# Altium project roach2_project rev2.PrjPCB (part 7 of 13)

## Sheet v6_io_12_13_14_15.SchDoc: Virtex-6 IO Banks 12, 13, 14 & 15
size A3; Date: DO NOT USE, RATHER USE PROJ OPTIONS; DrawnBy: DO NOT USE, RATHER USE PROJ OPTIONS; Engineer: DO NOT USE, RATHER USE PROJ OPTIONS; Organization: DO NOT USE, RATHER USE PROJ OPTIONS; DocumentNumber: DO NOT USE, RATHER USE PROJ OPTIONS; Revision: DO NOT USE, RATHER USE PROJ OPTIONS; SheetNumber: 14; SheetTotal: 27; SCH_Sheet_Filename: v6_io_12_13_14_15.SchDoc; CurrentTime: DO NOT USE, RATHER USE PROJ OPTIONS; Time: DO NOT USE, RATHER USE PROJ OPTIONS; DocumentFullPathAndName: DO NOT USE, RATHER USE PROJ OPTIONS; DocumentName: DO NOT USE, RATHER USE PROJ OPTIONS; ModifiedDate: DO NOT USE, RATHER USE PROJ OPTIONS; ImagePath: DO NOT USE, RATHER USE PROJ OPTIONS
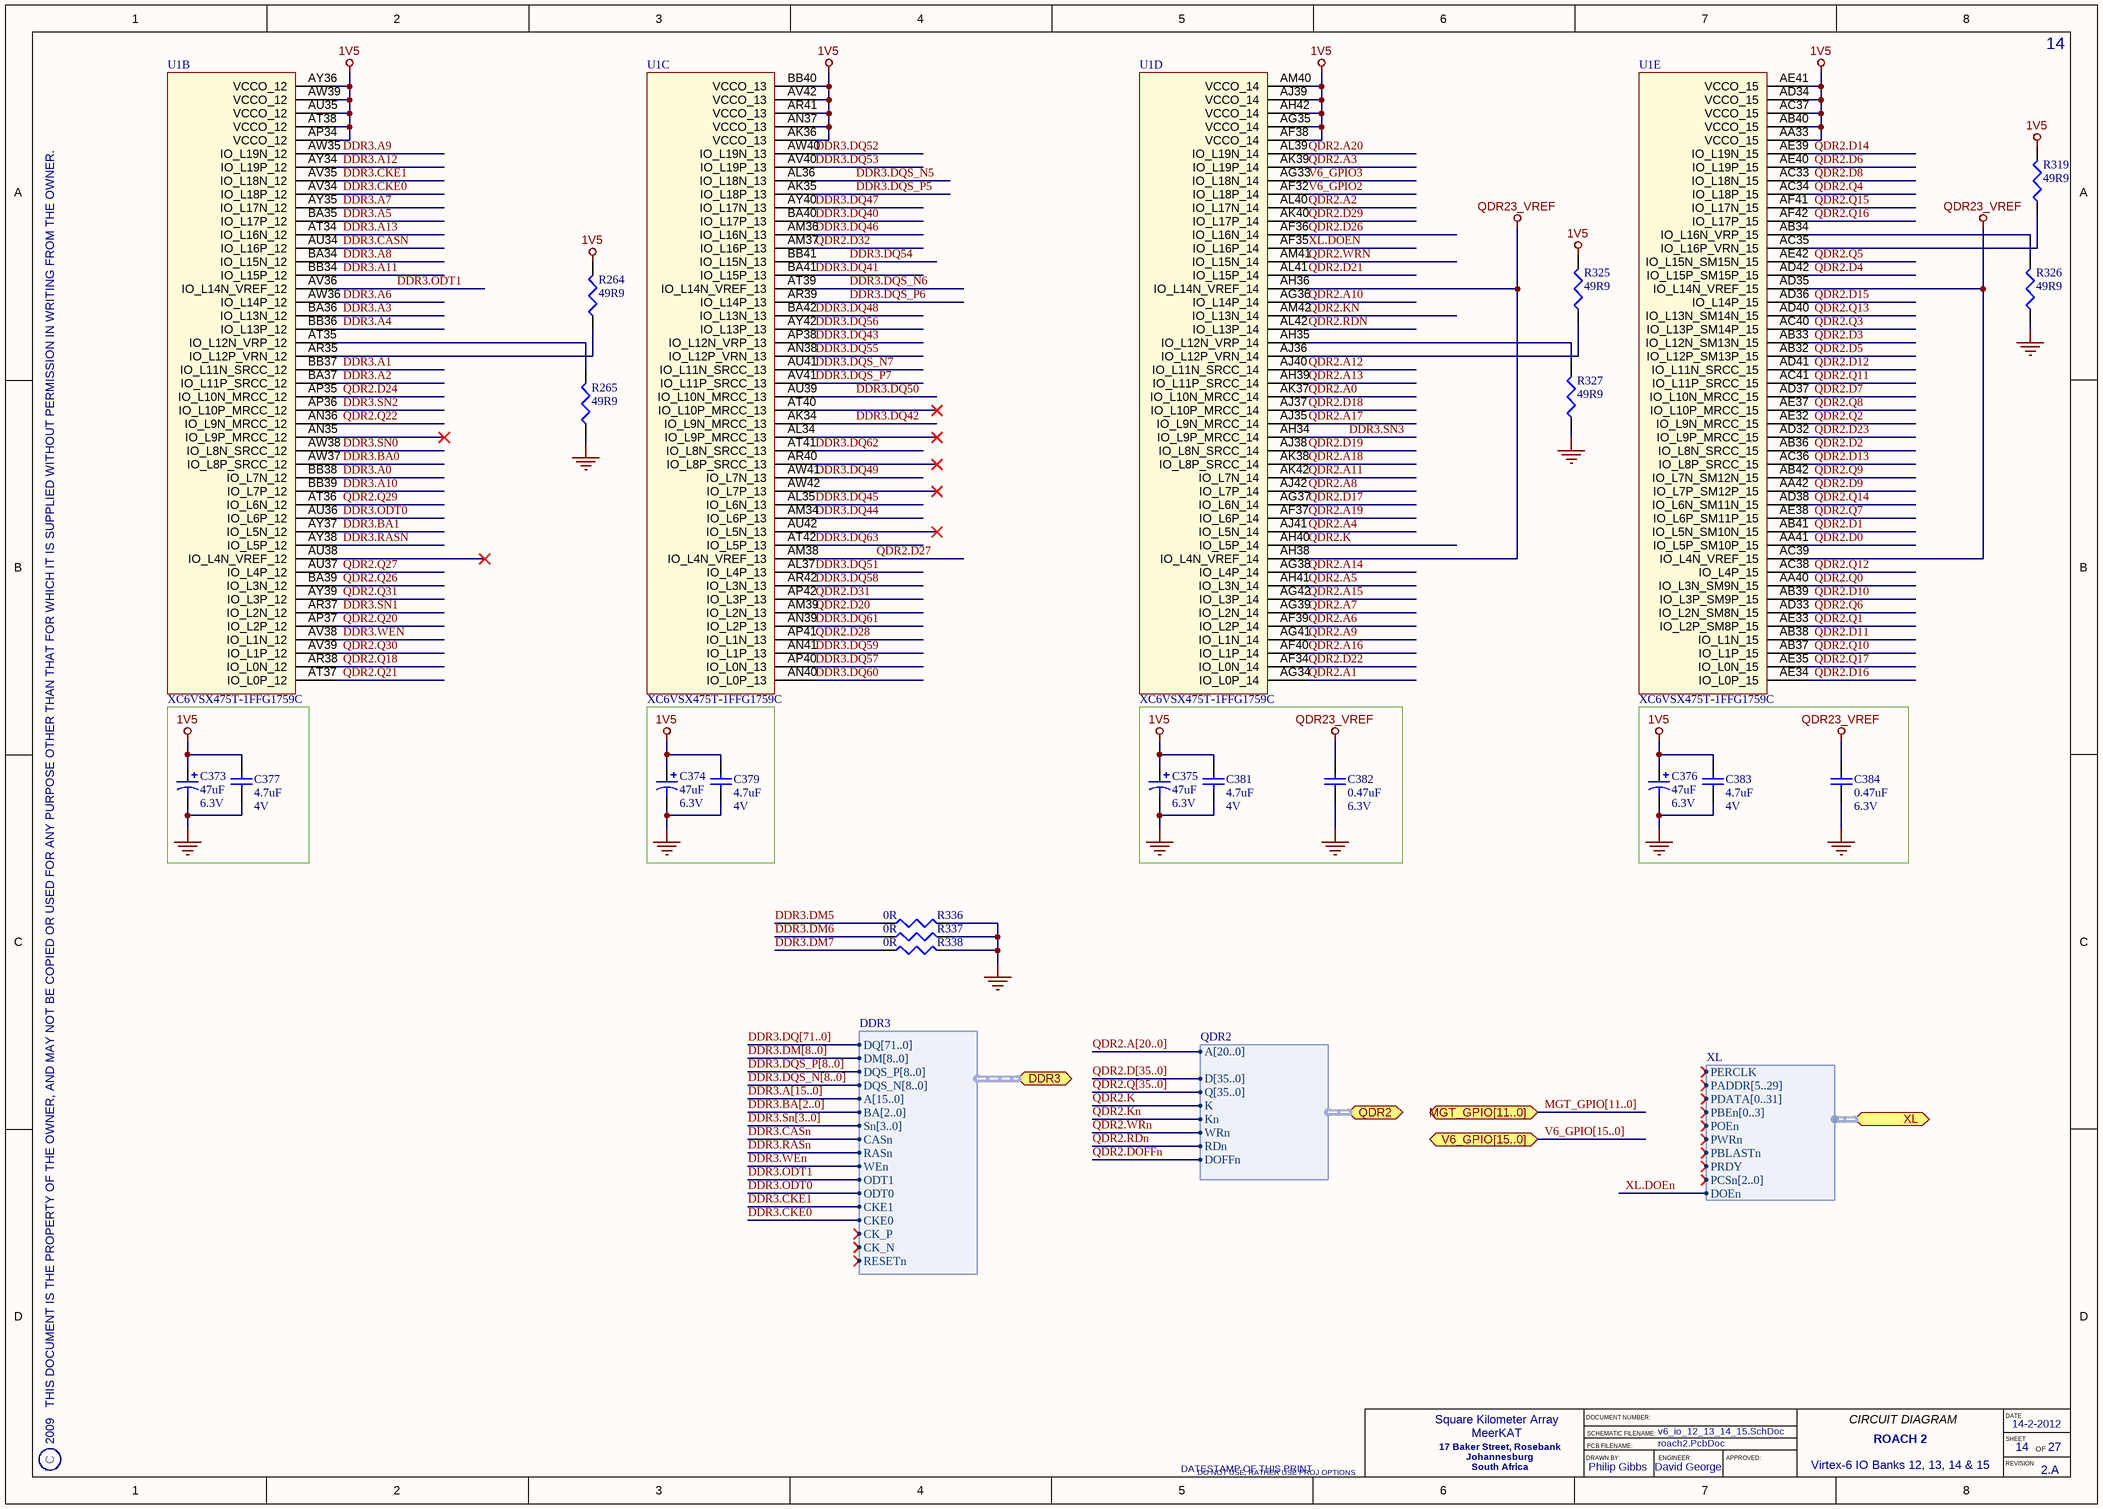
[diagram p14: v6_io_12_13_14_15.SchDoc]

### Parts
C373  Rating: 6.3V  [CAPMP3528X120L]  (hidden comment: 47uF)
C374  Rating: 6.3V  [CAPMP3528X120L]  (hidden comment: 47uF)
C375  Rating: 6.3V  [CAPMP3528X120L]  (hidden comment: 47uF)
C376  Rating: 6.3V  [CAPMP3528X120L]  (hidden comment: 47uF)
C377  Rating: 4V  [CAPC1005X60L]  (hidden comment: 4.7uF)
C379  Rating: 4V  [CAPC1005X60L]  (hidden comment: 4.7uF)
C381  Rating: 4V  [CAPC1005X60L]  (hidden comment: 4.7uF)
C382  Rating: 6.3V  [CAPC1005X55L]  (hidden comment: 0.47uF)
C383  Rating: 4V  [CAPC1005X60L]  (hidden comment: 4.7uF)
C384  Rating: 6.3V  [CAPC1005X55L]  (hidden comment: 0.47uF)
R264  49R9  [RESC1005X40L]
R265  49R9  [RESC1005X40L]
R319  49R9  [RESC1005X40L]
R325  49R9  [RESC1005X40L]
R326  49R9  [RESC1005X40L]
R327  49R9  [RESC1005X40L]
R336  0R  [RESC1005X40L]
R337  0R  [RESC1005X40L]
R338  0R  [RESC1005X40L]
U1  XC6VSX475T-1FFG1759C  [FFG1759]  (parts B,C,D,E of 39)

### Ports
DDR3 (harness DDR3), MGT_GPIO[11..0] (bidir), QDR2 (harness QDR2), V6_GPIO[15..0] (bidir), XL (harness XL)

### Harnesses
QDR2: A[20..0], D[35..0], Q[35..0], K, Kn, WRn, RDn, DOFFn
DDR3: DQ[71..0], DM[8..0], DQS_P[8..0], DQS_N[8..0], A[15..0], BA[2..0], Sn[3..0], CASn, RASn, WEn, ODT1, ODT0, CKE1, CKE0, CK_P, CK_N, RESETn
XL: PERCLK, PADDR[5..29], PDATA[0..31], PBEn[0..3], POEn, PWRn, PBLASTn, PRDY, PCSn[2..0], DOEn

### Nets
1V5: C373.1 C374.1 C375.1 C376.1 C377.2 C379.2 C381.2 C383.2 R264.2 R319.2 R325.2 U1.AA33(VCCO_15) U1.AB40(VCCO_15) U1.AC37(VCCO_15) U1.AD34(VCCO_15) U1.AE41(VCCO_15) U1.AF38(VCCO_14) U1.AG35(VCCO_14) U1.AH42(VCCO_14) U1.AJ39(VCCO_14) U1.AK36(VCCO_13) U1.AM40(VCCO_14) U1.AN37(VCCO_13) U1.AP34(VCCO_12) U1.AR41(VCCO_13) U1.AT38(VCCO_12) U1.AU35(VCCO_12) U1.AV42(VCCO_13) U1.AW39(VCCO_12) U1.AY36(VCCO_12) U1.BB40(VCCO_13)
GND: C373.2 C374.2 C375.2 C376.2 C377.1 C379.1 C381.1 C382.1 C383.1 C384.1 R265.1 R326.1 R327.1 R336.2 R337.2 R338.2
QDR23_VREF: C382.2 C384.2 U1.AC39(IO_L4N_VREF_15) U1.AD35(IO_L14N_VREF_15) U1.AH36(IO_L14N_VREF_14) U1.AH38(IO_L4N_VREF_14)
DDR3.A0: U1.BB38(IO_L7N_12)
DDR3.A1: U1.BB37(IO_L11N_SRCC_12)
DDR3.A2: U1.BA37(IO_L11P_SRCC_12)
DDR3.A3: U1.BA36(IO_L13N_12)
DDR3.A4: U1.BB36(IO_L13P_12)
DDR3.A5: U1.BA35(IO_L17P_12)
DDR3.A6: U1.AW36(IO_L14P_12)
DDR3.A7: U1.AY35(IO_L17N_12)
DDR3.A8: U1.BA34(IO_L15N_12)
DDR3.A9: U1.AW35(IO_L19N_12)
DDR3.A10: U1.BB39(IO_L7P_12)
DDR3.A11: U1.BB34(IO_L15P_12)
DDR3.A12: U1.AY34(IO_L19P_12)
DDR3.A13: U1.AT34(IO_L16N_12)
DDR3.BA0: U1.AW37(IO_L8P_SRCC_12)
DDR3.BA1: U1.AY37(IO_L5N_12)
DDR3.CASn: U1.AU34(IO_L16P_12) ; port DDR3.CASn
DDR3.CKE0: U1.AV34(IO_L18P_12) ; port DDR3.CKE0
DDR3.CKE1: U1.AV35(IO_L18N_12) ; port DDR3.CKE1
DDR3.DM5: R336.1
DDR3.DM6: R337.1
DDR3.DM7: R338.1
DDR3.DQ40: U1.BA40(IO_L17P_13)
DDR3.DQ41: U1.BA41(IO_L15P_13)
DDR3.DQ42: U1.AK34(IO_L9N_MRCC_13)
DDR3.DQ43: U1.AP38(IO_L12N_VRP_13)
DDR3.DQ44: U1.AM34(IO_L6P_13)
DDR3.DQ45: U1.AL35(IO_L6N_13)
DDR3.DQ46: U1.AM36(IO_L16N_13)
DDR3.DQ47: U1.AY40(IO_L17N_13)
DDR3.DQ48: U1.BA42(IO_L13N_13)
DDR3.DQ49: U1.AW41(IO_L7N_13)
DDR3.DQ50: U1.AU39(IO_L10N_MRCC_13)
DDR3.DQ51: U1.AL37(IO_L4P_13)
DDR3.DQ52: U1.AW40(IO_L19N_13)
DDR3.DQ53: U1.AV40(IO_L19P_13)
DDR3.DQ54: U1.BB41(IO_L15N_13)
DDR3.DQ55: U1.AN38(IO_L12P_VRN_13)
DDR3.DQ56: U1.AY42(IO_L13P_13)
DDR3.DQ57: U1.AP40(IO_L0N_13)
DDR3.DQ58: U1.AR42(IO_L3N_13)
DDR3.DQ59: U1.AN41(IO_L1P_13)
DDR3.DQ60: U1.AN40(IO_L0P_13)
DDR3.DQ61: U1.AN39(IO_L2P_13)
DDR3.DQ62: U1.AT41(IO_L8N_SRCC_13)
DDR3.DQ63: U1.AT42(IO_L5P_13)
DDR3.DQS_N5: U1.AL36(IO_L18N_13)
DDR3.DQS_N6: U1.AT39(IO_L14N_VREF_13)
DDR3.DQS_N7: U1.AU41(IO_L11N_SRCC_13)
DDR3.DQS_P5: U1.AK35(IO_L18P_13)
DDR3.DQS_P6: U1.AR39(IO_L14P_13)
DDR3.DQS_P7: U1.AV41(IO_L11P_SRCC_13)
DDR3.ODT0: U1.AU36(IO_L6P_12) ; port DDR3.ODT0
DDR3.ODT1: U1.AV36(IO_L14N_VREF_12) ; port DDR3.ODT1
DDR3.RASn: U1.AY38(IO_L5P_12) ; port DDR3.RASn
DDR3.Sn0: U1.AW38(IO_L8N_SRCC_12)
DDR3.Sn1: U1.AR37(IO_L2N_12)
DDR3.Sn2: U1.AP36(IO_L10P_MRCC_12)
DDR3.Sn3: U1.AH34(IO_L9P_MRCC_14)
DDR3.WEn: U1.AV38(IO_L1N_12) ; port DDR3.WEn
QDR2.A0: U1.AK37(IO_L10N_MRCC_14)
QDR2.A1: U1.AG34(IO_L0P_14)
QDR2.A2: U1.AL40(IO_L17N_14)
QDR2.A3: U1.AK39(IO_L19P_14)
QDR2.A4: U1.AJ41(IO_L5N_14)
QDR2.A5: U1.AH41(IO_L3N_14)
QDR2.A6: U1.AF39(IO_L2P_14)
QDR2.A7: U1.AG39(IO_L2N_14)
QDR2.A8: U1.AJ42(IO_L7P_14)
QDR2.A9: U1.AG41(IO_L1N_14)
QDR2.A10: U1.AG36(IO_L14P_14)
QDR2.A11: U1.AK42(IO_L7N_14)
QDR2.A12: U1.AJ40(IO_L11N_SRCC_14)
QDR2.A13: U1.AH39(IO_L11P_SRCC_14)
QDR2.A14: U1.AG38(IO_L4P_14)
QDR2.A15: U1.AG42(IO_L3P_14)
QDR2.A16: U1.AF40(IO_L1P_14)
QDR2.A17: U1.AJ35(IO_L9N_MRCC_14)
QDR2.A18: U1.AK38(IO_L8P_SRCC_14)
QDR2.A19: U1.AF37(IO_L6P_14)
QDR2.A20: U1.AL39(IO_L19N_14)
QDR2.D0: U1.AA41(IO_L5P_SM10P_15)
QDR2.D1: U1.AB41(IO_L5N_SM10N_15)
QDR2.D2: U1.AB36(IO_L8N_SRCC_15)
QDR2.D3: U1.AB33(IO_L12N_SM13N_15)
QDR2.D4: U1.AD42(IO_L15P_SM15P_15)
QDR2.D5: U1.AB32(IO_L12P_SM13P_15)
QDR2.D6: U1.AE40(IO_L19P_15)
QDR2.D7: U1.AD37(IO_L10N_MRCC_15)
QDR2.D8: U1.AC33(IO_L18N_15)
QDR2.D9: U1.AA42(IO_L7P_SM12P_15)
QDR2.D10: U1.AB39(IO_L3P_SM9P_15)
QDR2.D11: U1.AB38(IO_L1N_15)
QDR2.D12: U1.AD41(IO_L11N_SRCC_15)
QDR2.D13: U1.AC36(IO_L8P_SRCC_15)
QDR2.D14: U1.AE39(IO_L19N_15)
QDR2.D15: U1.AD36(IO_L14P_15)
QDR2.D16: U1.AE34(IO_L0P_15)
QDR2.D17: U1.AG37(IO_L6N_14)
QDR2.D18: U1.AJ37(IO_L10P_MRCC_14)
QDR2.D19: U1.AJ38(IO_L8N_SRCC_14)
QDR2.D20: U1.AM39(IO_L2N_13)
QDR2.D21: U1.AL41(IO_L15P_14)
QDR2.D22: U1.AF34(IO_L0N_14)
QDR2.D23: U1.AD32(IO_L9P_MRCC_15)
QDR2.D24: U1.AP35(IO_L10N_MRCC_12)
QDR2.D26: U1.AF36(IO_L16N_14)
QDR2.D27: U1.AM38(IO_L4N_VREF_13)
QDR2.D28: U1.AP41(IO_L1N_13)
QDR2.D29: U1.AK40(IO_L17P_14)
QDR2.D31: U1.AP42(IO_L3P_13)
QDR2.D32: U1.AM37(IO_L16P_13)
QDR2.K: U1.AH40(IO_L5P_14) ; port QDR2.K
QDR2.Kn: U1.AM42(IO_L13N_14) ; port QDR2.Kn
QDR2.Q0: U1.AA40(IO_L3N_SM9N_15)
QDR2.Q1: U1.AE33(IO_L2P_SM8P_15)
QDR2.Q2: U1.AE32(IO_L9N_MRCC_15)
QDR2.Q3: U1.AC40(IO_L13P_SM14P_15)
QDR2.Q4: U1.AC34(IO_L18P_15)
QDR2.Q5: U1.AE42(IO_L15N_SM15N_15)
QDR2.Q6: U1.AD33(IO_L2N_SM8N_15)
QDR2.Q7: U1.AE38(IO_L6P_SM11P_15)
QDR2.Q8: U1.AE37(IO_L10P_MRCC_15)
QDR2.Q9: U1.AB42(IO_L7N_SM12N_15)
QDR2.Q10: U1.AB37(IO_L1P_15)
QDR2.Q11: U1.AC41(IO_L11P_SRCC_15)
QDR2.Q12: U1.AC38(IO_L4P_15)
QDR2.Q13: U1.AD40(IO_L13N_SM14N_15)
QDR2.Q14: U1.AD38(IO_L6N_SM11N_15)
QDR2.Q15: U1.AF41(IO_L17N_15)
QDR2.Q16: U1.AF42(IO_L17P_15)
QDR2.Q17: U1.AE35(IO_L0N_15)
QDR2.Q18: U1.AR38(IO_L0N_12)
QDR2.Q20: U1.AP37(IO_L2P_12)
QDR2.Q21: U1.AT37(IO_L0P_12)
QDR2.Q22: U1.AN36(IO_L9N_MRCC_12)
QDR2.Q26: U1.BA39(IO_L3N_12)
QDR2.Q27: U1.AU37(IO_L4P_12)
QDR2.Q29: U1.AT36(IO_L6N_12)
QDR2.Q30: U1.AV39(IO_L1P_12)
QDR2.Q31: U1.AY39(IO_L3P_12)
QDR2.RDn: U1.AL42(IO_L13P_14) ; port QDR2.RDn
QDR2.WRn: U1.AM41(IO_L15N_14) ; port QDR2.WRn
V6_GPIO2: U1.AF32(IO_L18P_14)
V6_GPIO3: U1.AG33(IO_L18N_14)
XL.DOEn: U1.AF35(IO_L16P_14) ; port XL.DOEn
NetR264_1: R264.1 U1.AR35(IO_L12P_VRN_12)
NetR265_2: R265.2 U1.AT35(IO_L12N_VRP_12)
NetR319_1: R319.1 U1.AC35(IO_L16P_VRN_15)
NetR325_1: R325.1 U1.AJ36(IO_L12P_VRN_14)
NetR326_2: R326.2 U1.AB34(IO_L16N_VRP_15)
NetR327_2: R327.2 U1.AH35(IO_L12N_VRP_14)

Not connected (* = marked no-connect by the designer): U1 AL34(IO_L9P_MRCC_13)* AN35(IO_L9P_MRCC_12)* AR40(IO_L8P_SRCC_13)* AT40(IO_L10P_MRCC_13)* AU38(IO_L4N_VREF_12)* AU42(IO_L5N_13)* AW42(IO_L7P_13)*

### Buses and harness runs
bus DDR3.A[15..0]
bus DDR3.BA[2..0]
bus DDR3.DM[8..0]
bus DDR3.DQ[71..0]
bus DDR3.DQS_N[8..0]
bus DDR3.DQS_P[8..0]
bus DDR3.Sn[3..0]
bus MGT_GPIO[11..0] = port MGT_GPIO[11..0]
bus QDR2.A[20..0]
bus QDR2.D[35..0]
bus QDR2.Q[35..0]
bus V6_GPIO[15..0] = port V6_GPIO[15..0]

### Notes on the sheet
- 2009   THIS DOCUMENT IS THE PROPERTY OF THE OWNER, AND MAY NOT BE COPIED OR USED FOR ANY PURPOSE OTHER THAN THAT FOR WHICH IT IS SUPPLIED WITHOUT PERMISSION IN WRITING FROM THE OWNER.
- C
- DATESTAMP OF THIS PRINT
- DRAWN BY:
- DOCUMENT NUMBER:
- SCHEMATIC FILENAME:
- PCB FILENAME:
- ENGINEER:
- APPROVED:
- CIRCUIT DIAGRAM
- DATE
- SHEET
- REVISION
- OF

### Library data of the parts
C373-C376 = CAP-TAN-1: as C361 on sheet v6_config_io_16_17_21_22; POD number: CAP-TAN-1; Value: 47uF; RoHS: Y; Sort Value: 47; Category: Capacitors; Subcategory: Tantalum
C377 C379 C381 C383 = CAP-CER-11: as C365 on sheet v6_config_io_16_17_21_22; POD number: CAP-CER-11; Value: 4.7uF; RoHS: Y; Sort Value: 4.7; Category: Capacitors; Subcategory: Ceramic
C382 C384 = CAP-CER-7: as C553 on sheet qdr0_1; POD number: CAP-CER-7; Value: 0.47uF; RoHS: Y; Sort Value: 0.47; Category: Capacitors; Subcategory: Ceramic
R264 R265 R319 R325-R327 = RES-TF-10: as R114 on sheet qdr0_1; POD number: RES-TF-10; Value: 49R9; Sort Value: 49.9; Category: Resistors; Subcategory: ThickFilm; HelpURL: *.pdf
R336-R338 = RES-TF-0: as R301-R308 on sheet qdr0_1; POD number: RES-TF-0; Value: 0R; Sort Value: 0; Category: Resistors; Subcategory: ThickFilm; HelpURL: *.pdf
U1 = IC-PLD-0: as U1 on sheet v6_config_io_16_17_21_22; POD number: IC-PLD-0; PartNum: XC6VSX475T-1FFG1759C; RoHS: Y; Category: IC; Subcategory: PLD